# EAGLE design powerSMALL (EAGLE 9.0.0)
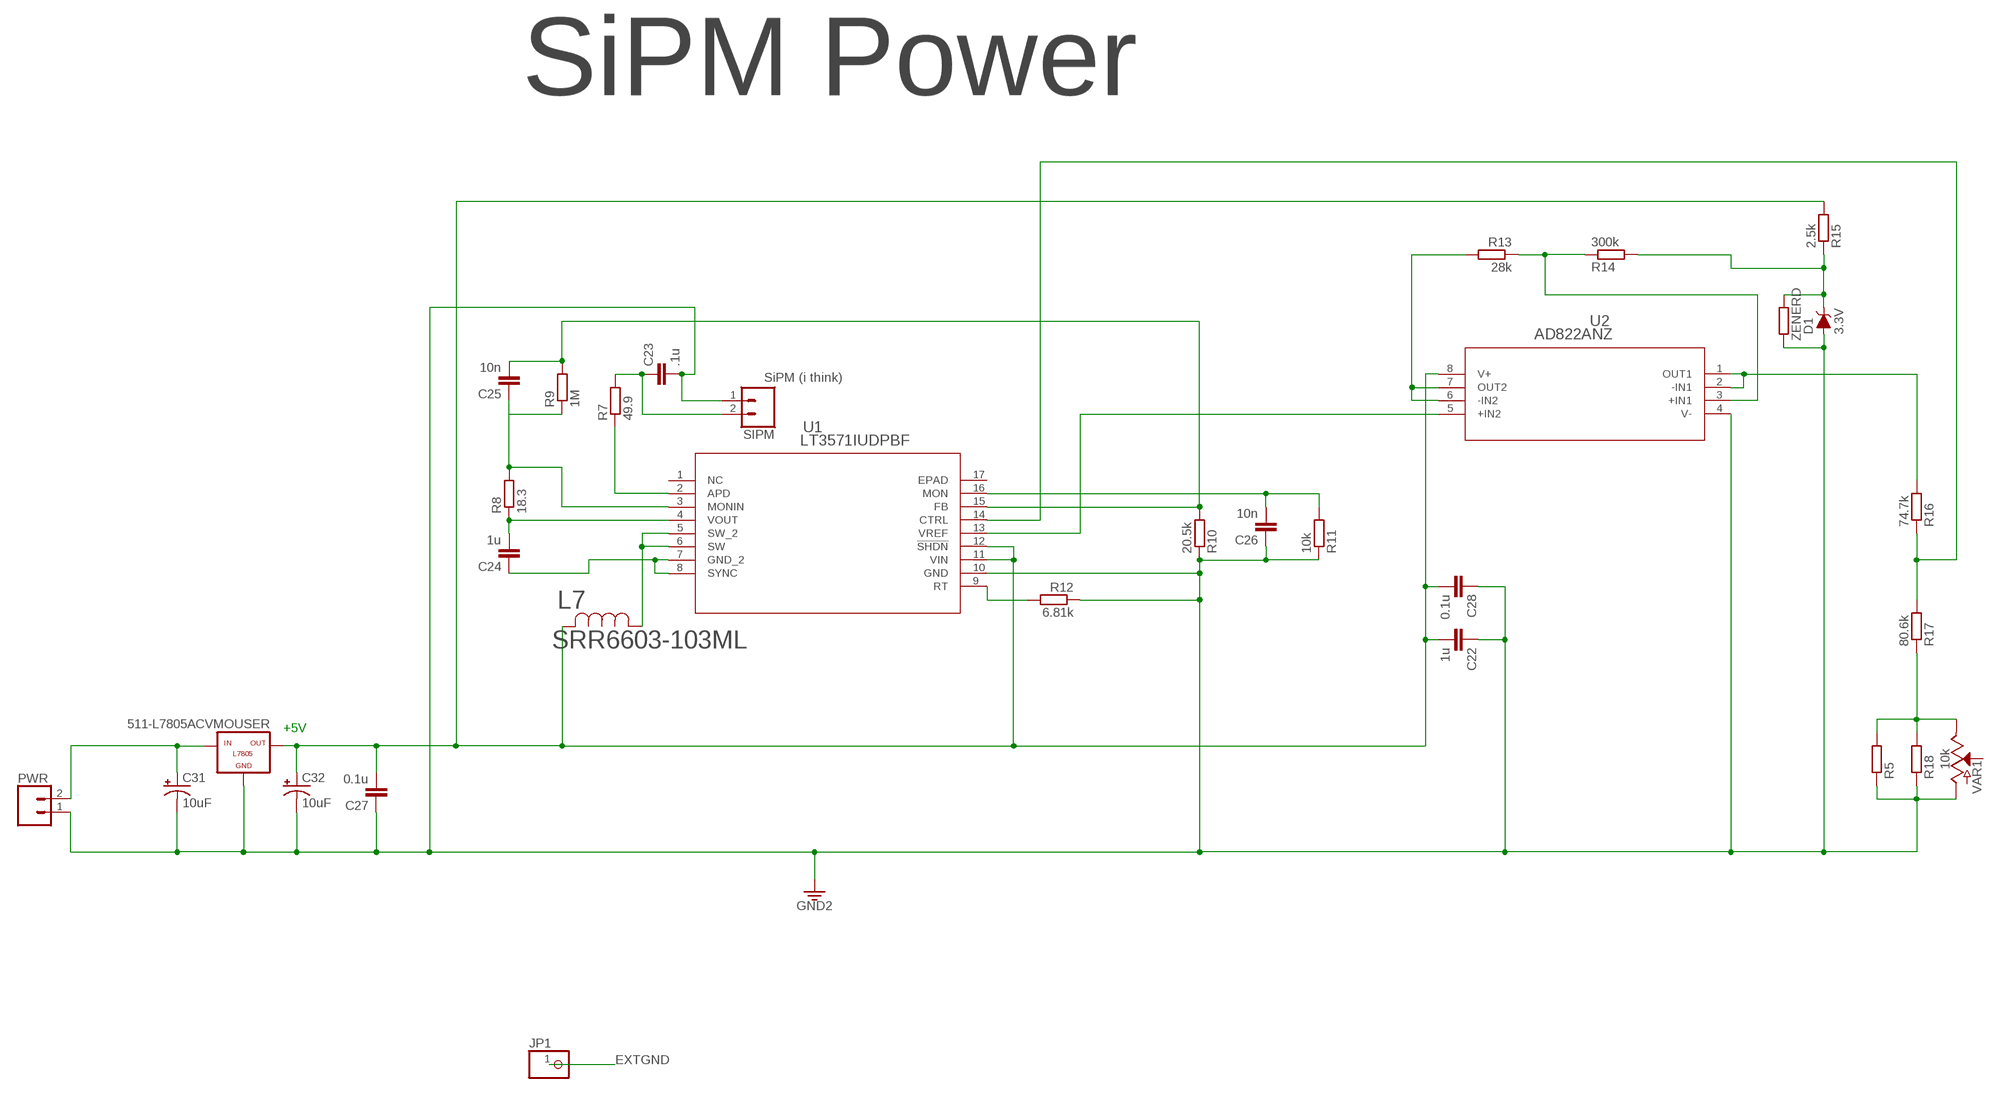
[diagram p0: schematic, sheet 1, part 1 of 2]
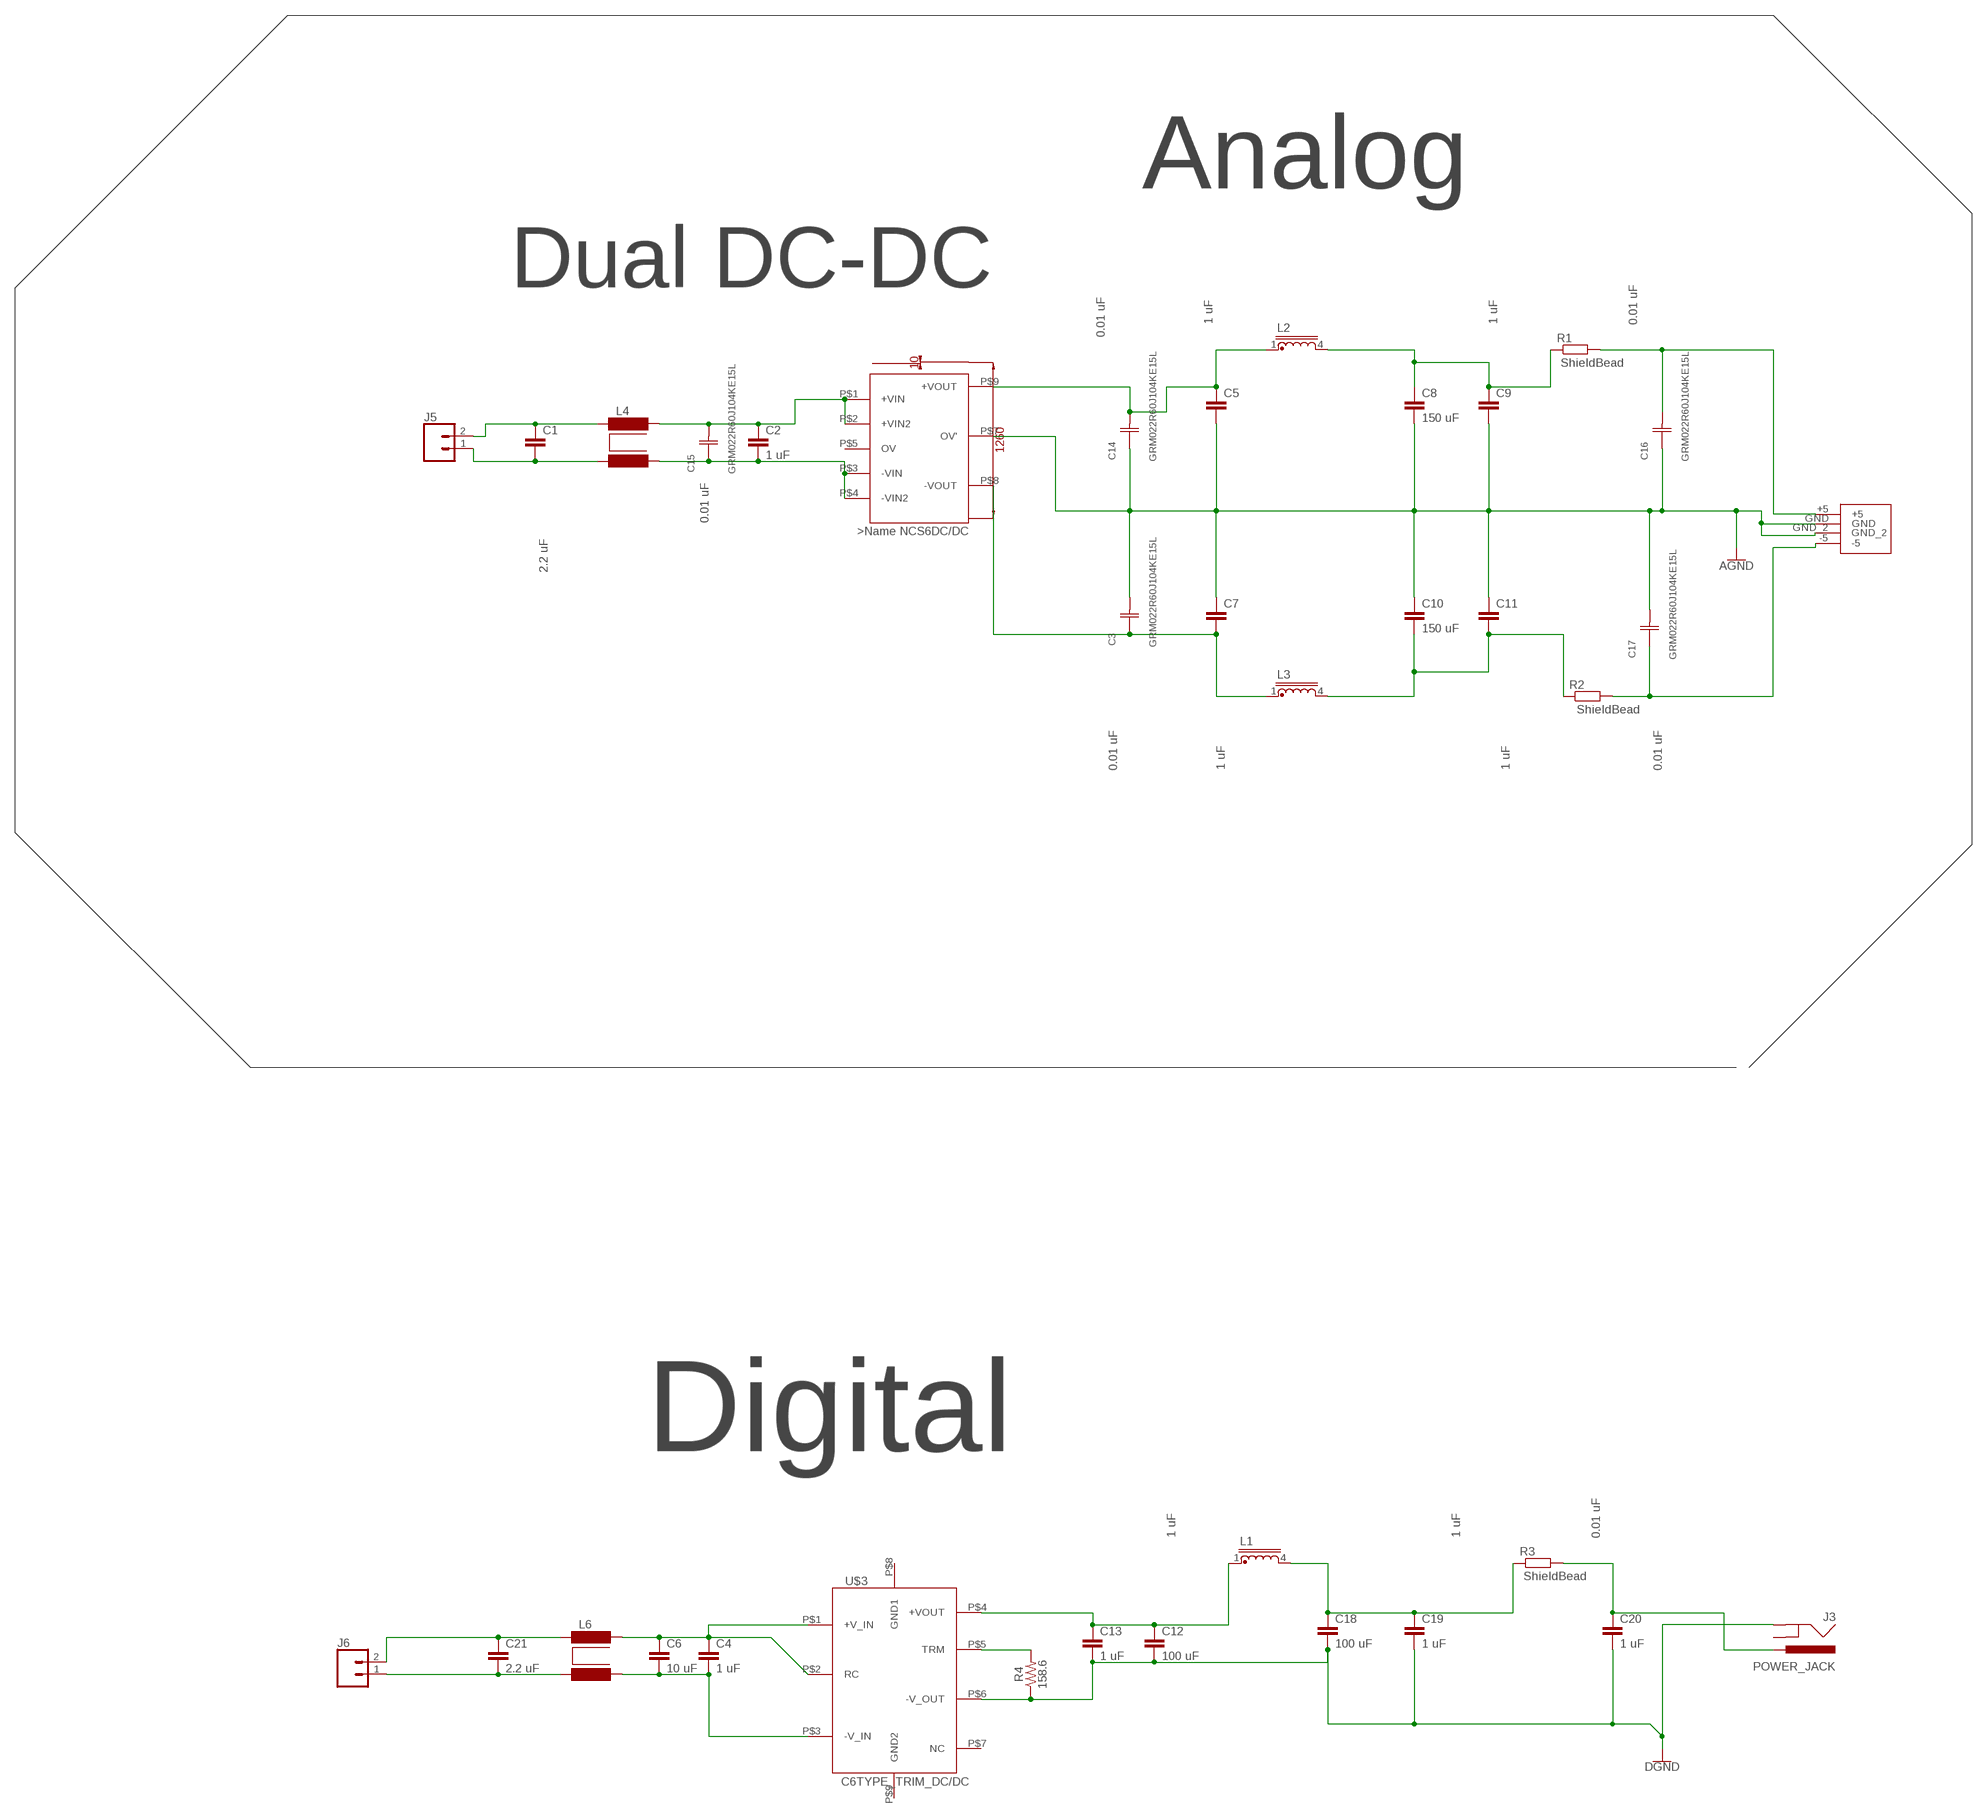
[diagram p1: schematic, sheet 1, part 2 of 2]

## Parts
511-L7805ACVMOUSER  -L7805  [L7805]
C1  C2.5/2  [C2.5-2]
C2  1 uF  10NF-PTH-10MM-10000V-1-%  [CAP-PTH-10MM]
C3  GRM022R60J104KE15L  [CAP_GRM02L_P42XP22]
C4  1 uF  10NF-PTH-10MM-10000V-1-%  [CAP-PTH-10MM]
C5  C2.5/2  [C2.5-2]
C6  10 uF  10NF-PTH-10MM-10000V-1-%  [CAP-PTH-10MM]
C7  C2.5/2  [C2.5-2]
C8  150 uF  10NF-PTH-10MM-10000V-1-%  [CAP-PTH-10MM]
C9  C2.5/2  [C2.5-2]
C10  150 uF  10NF-PTH-10MM-10000V-1-%  [CAP-PTH-10MM]
C11  C2.5/2  [C2.5-2]
C12  100 uF  10NF-PTH-10MM-10000V-1-%  [CAP-PTH-10MM]
C13  1 uF  10NF-PTH-10MM-10000V-1-%  [CAP-PTH-10MM]
C14  GRM022R60J104KE15L  [CAP_GRM02L_P42XP22]
C15  GRM022R60J104KE15L  [CAP_GRM02L_P42XP22]
C16  GRM022R60J104KE15L  [CAP_GRM02L_P42XP22]
C17  GRM022R60J104KE15L  [CAP_GRM02L_P42XP22]
C18  100 uF  10NF-PTH-10MM-10000V-1-%  [CAP-PTH-10MM]
C19  1 uF  10NF-PTH-10MM-10000V-1-%  [CAP-PTH-10MM]
C20  1 uF  10NF-PTH-10MM-10000V-1-%  [CAP-PTH-10MM]
C21  2.2 uF  10NF-PTH-10MM-10000V-1-%  [CAP-PTH-10MM]
C22  1u  C2.5/2  [C2.5-2]
C23  .1u  C2.5/2  [C2.5-2]
C24  1u  C2.5/2  [C2.5-2]
C25  10n  C2.5/2  [C2.5-2]
C26  10n  C2.5/2  [C2.5-2]
C27  0.1u  C2.5/2  [C2.5-2]
C28  0.1u  C2.5/2  [C2.5-2]
C31  10uF  10UF-POLAR-0603-6.3V-20%(TANT)  [0603-POLAR]
C32  10uF  10UF-POLAR-0603-6.3V-20%(TANT)  [0603-POLAR]
D1  3.3V  DIODE-ZENER-MM3Z3V3T1G  [SOD-323]
J3  POWER_JACK  [POWER_JACK_PTH]
J5  CONN_02PTH4  [1X02_XTRA_BIG]
J6  CONN_02PTH4  [1X02_XTRA_BIG]
JP1  PINHD-1X1  [1X01]
L1  U15-CHOKE  [U15CHOKE]
L2  U15-CHOKE  [U15CHOKE]
L3  U15-CHOKE  [U15CHOKE]
L4  SMR6-I  [SM-R6]
L6  SMR6-I  [SM-R6]
L7  SRR6603-103ML  [IND_BOURNS_SRR6603]
PWR  CONN_02PTH4  [1X02_XTRA_BIG]
R1  R0207/10  [0207/10]
R2  R0207/10  [0207/10]
R3  R0207/10  [0207/10]
R4  158.6  10MOHM-HORIZ-1/4W-5%  [AXIAL-0.3]
R5  R0207/10  [0207/10]
R7  49.9  R0207/10  [0207/10]
R8  18.3  R0207/10  [0207/10]
R9  1M  R0207/10  [0207/10]
R10  20.5k  R0207/10  [0207/10]
R11  10k  R0207/10  [0207/10]
R12  6.81k  R0207/10  [0207/10]
R13  28k  R0207/10  [0207/10]
R14  300k  R0207/10  [0207/10]
R15  2.5k  R0207/10  [0207/10]
R16  74.7k  R0207/10  [0207/10]
R17  80.6k  R0207/10  [0207/10]
R18  R0207/10  [0207/10]
SIPM  CONN_02PTH4  [1X02_XTRA_BIG]
U1  LT3571IUDPBF  [QFN-16_UD]
U2  AD822ANZ  [N_8]
U$1  NCS6D1205  [NCS6D1205C]
U$3  C6TYPE_TRIM_DC/DC  [CONV/DC/DC_6W_SNGL_C6TYPE]
U$4  WM403_NDPOWER_JACK  [WM4302-ND]
VAR1  10k  POTENTIOMETER-PTH-9MM-1/20W-20%  [POT-PTH-ALPS]
ZENERD  R0207/10  [0207/10]

## Nets
5VSUPPLY: 511-L7805ACVMOUSER.OUT C22.2 C27.2 C28.2 C32.+ L7.2 R15.2 U1.11(VIN) U1.12(!SHDN) U2.8(V+)
-FINV: C16.2 R1.2 U$4.+5
AGND: C3.2 C5.2 C7.1 C8.2 C9.2 C10.1 C11.1 C14.1 C16.1 C17.2 U$1.P$7(OV') U$4.GND U$4.GND_2
DGND: C12.2 C13.2 C18.2 C19.2 C20.2 J3.GND R4.P$1 U$3.P$6(-V_OUT)
EXTGND: JP1.1
N$1: C1.1 J5.2 L4.1
N$2: C1.2 J5.1 L4.4
N$3: C3.1 C7.2 L3.1 U$1.P$8(-VOUT)
N$4: C2.1 C15.2 L4.8 U$1.P$1(+VIN) U$1.P$2(+VIN2)
N$5: C5.1 C14.2 L2.1 U$1.P$9(+VOUT)
N$6: C8.1 C9.1 L2.4 R1.1
N$7: R13.2 U2.6(-IN2) U2.7(OUT2)
N$8: C10.2 C11.2 L3.4 R2.1
N$9: C17.1 R2.2 U$4.-5
N$10: C21.1 J6.2 L6.1
N$11: C21.2 J6.1 L6.4
N$12: C4.1 C6.1 L6.8 U$3.P$1(+V_IN) U$3.P$2(RC)
N$13: C4.2 C6.2 L6.5 U$3.P$3(-V_IN)
N$14: C24.2 R8.1 U1.4(VOUT)
N$15: C20.1 J3.PWR R3.2
N$16: R4.P$2 U$3.P$5(TRM)
N$17: C18.1 C19.1 L1.4 R3.1
N$18: C24.1 U1.7(GND_2) U1.8(SYNC)
N$19: C12.1 C13.1 L1.1 U$3.P$4(+VOUT)
N$20: R7.1 U1.2(APD)
N$21: C23.1 R7.2 SIPM.2
N$22: C25.1 R8.2 R9.1 U1.3(MONIN)
N$23: C26.2 R11.2 U1.16(MON)
N$24: L7.1 U1.5(SW_2) U1.6(SW)
N$25: U1.13(VREF) U2.5(+IN2)
N$27: R16.2 U2.1(OUT1) U2.2(-IN1)
N$28: C25.2 R9.2 R10.2 U1.15(FB)
N$29: R13.1 R14.1 U2.3(+IN1)
N$30: R12.2 U1.9(RT)
N$31: D1.C R14.2 R15.1 ZENERD.2
N$33: R16.1 R17.2 U1.14(CTRL)
N$34: R5.2 R17.1 R18.2 VAR1.P$1(E)
N$35: C2.2 C15.1 L4.5 U$1.P$3(-VIN) U$1.P$4(-VIN2)
N$36: 511-L7805ACVMOUSER.IN C31.+ PWR.2
SIPMGND: 511-L7805ACVMOUSER.GND C22.1 C23.2 C26.1 C27.1 C28.1 C31.- C32.- D1.A PWR.1 R5.1 R10.1 R11.1 R12.1 R18.1 SIPM.1 U1.10(GND) U2.4(V-) VAR1.P$3(A) ZENERD.1 ; supply symbol labelled GND2
Unconnected: J3.GNDBREAK U1.1(NC) U1.17(EPAD) U$1.P$5(OV) U$3.P$7(NC) U$3.P$8(GND1) U$3.P$9(GND2) VAR1.P$2(S)

## Notes on the sheet
- SiPM Power
- SiPM (i think)
- +5V
- Analog
- Dual DC-DC
- 1 uF | 1 uF
- 0.01 uF
- 0.01 uF
- ShieldBead
- 0.01 uF
- 2.2 uF
- ShieldBead
- 1 uF | 1 uF
- 0.01 uF | 0.01 uF
- Digital
- 1 uF | 1 uF
- 0.01 uF
- ShieldBead

## Library data of the parts
511-L7805ACVMOUSER = tango:-L7805
C1 C5 C7 C9 C11 C22-C28 = capacitor-wima:C: CAPACITOR naming: grid - package width
C2 C4 C6 C8 C10 C12 C13 C18-C21 = SparkFun-Capacitors:10NF: 0.01uF/10nF/10,000pF ceramic capacitors A capacitor is a passive two-terminal electrical component used to store electrical energy temporarily in an electric field. CAP-09321; PROD_ID: CAP-09321; VALUE: 10nF
C3 C14-C17 = 00_1uFCeramic:GRM022R60J104KE15L; MANUFACTURER_PART_NUMBER: GRM022R60J104KE15L; VENDOR: Murata
C31 C32 = SparkFun-Capacitors:10UF-POLAR: 10.0µF polarized capacitors A capacitor is a passive two-terminal electrical component used to store electrical energy temporarily in an electric field.; PROD_ID: CAP-13210
D1 = SparkFun-DiscreteSemi:DIODE-ZENER: Zener Diode A Zener diode allows current to flow from its anode to its cathode like a normal semiconductor diode, but it also permits current to flow in the reverse direction when its "Zener voltage" is reached. - WIkipedia; PROD_ID: DIO-11284
J3 = SparkFun-Connectors:POWER_JACK: Power Jack Connector This is the standard 5.5mm barrel jack for power. The PTH is the most common, proven, reliable, footprint. The Slot footprint only works if the mill layer is transmitted to the PCB fab house so be warned. Here are the connectors we sell at SparkFun: DC Barrel Power Jack/Connector <https://www.sparkfun.com/products/119> (PRT-00119) DC Barrel Power Jack/Connector (SMD) <https://www.sparkfun.com/products/12748> (PRT-12748) DC Barrel Jack Adapter - Breadboard Compatible <https://www.sparkfun.com/products/10811> (PRT-10811) It is used on this SparkFun product (and many, many others): SparkFun RedBoard - Programmed with Arduino <https://www.sparkfun.com/products/12757> (DEV-12757) Also, if you need a mating power supply or connector, please check these out: Wall Adapter Power Supply - 9VDC 650mA <https://www.sparkfun.com/products/298> (TOL-00298) DC Barrel Jack Adapter - Male <https://www.sparkfun.com/products/10287> (PRT-10287); PROD_ID: CONN-08197
J5 J6 PWR SIPM = SparkFun-Connectors:CONN_02: Multi connection point. Often used as Generic Header-pin footprint for 0.1 inch spaced/style header connections On any of the 0.1 inch spaced packages, you can populate with these: Break Away Headers - Straight <https://www.sparkfun.com/products/116> (PRT-00116) Break Away Male Headers - Right Angle <https://www.sparkfun.com/products/553> (PRT-00553) Female Headers <https://www.sparkfun.com/products/115> (PRT-00115) Break Away Headers - Machine Pin <https://www.sparkfun.com/products/117> (PRT-00117) Break Away Female Headers - Swiss Machine Pin <https://www.sparkfun.com/products/743> (PRT-00743) For SCREWTERMINALS and SPRING TERMINALS visit here: Screw Terimnals on SparkFun.com <https://www.sparkfun.com/search/results?term=Screw+Terminals> (5mm/3.5mm/2.54mm spacing) This device is also useful as a general connection point to wire up your design to another part of your project. Our various solder wires solder well into these plated through hole pads. Hook-Up Wire - Assortment (Stranded, 22 AWG) <https://www.sparkfun.com/products/11375> (PRT-11375) Hook-Up Wire - Assortment (Solid Core, 22 AWG) <https://www.sparkfun.com/products/11367> (PRT-11367) View the entire wire category on our website here <https://www.sparkfun.com/categories/141> Special notes: Molex polarized connector foot print use with: PRT-08233 with associated crimp pins and housings. 2.54_SCREWTERM for use with PRT-10571. 3.5mm Screw Terminal footprints for PRT-08084 5mm Screw Terminal footprints for use with PRT-08432
JP1 = adafruit:PINHD-1X1: Pin header 1x1 for 0.1" spacing With round pins
L1-L3 = inductor-neosid:U15-: CHOKE U15; OC_FARNELL: unknown; OC_NEWARK: unknown
L4 L6 = inductor-neosid:SMR6-I: CHOKE current compensated toroidal-core choke; OC_FARNELL: unknown; OC_NEWARK: unknown
L7 = SRR6603-10MLTR-ND:SRR6603-103ML; MANUFACTURER_PART_NUMBER: SRR6603103ML; VENDOR: Bourns Electronics
R1-R3 R5 R7-R18 ZENERD = eagle-ltspice:R: RESISTOR, European symbol; SPICEMODEL: NONE; SPICEPREFIX: R
R4 = SparkFun-Resistors:10MOHM: RES-09327; PROD_ID: RES-09327; VALUE: 10M
U1 = LT3571:LT3571IUDPBF; MANUFACTURER_PART_NUMBER: LT3571IUD#PBF; VENDOR: Linear Technology
U2 = AD822ANZ_opAmp:AD822ANZ; MANUFACTURER_PART_NUMBER: AD822ANZ; VENDOR: Analog Devices Inc
U$1 = LAFTRPWR:NCS6D1205
U$3 = DCDC_Trim:C6TYPE_TRIM_DC/DC
U$4 = WM4302-ND:WM403_ND
VAR1 = SparkFun-Resistors:POTENTIOMETER: Potentiometer (Pot) Three-terminal potentiometers, with an adjustable wiper and two adjustable resistors. A pot can be used to create a configurable voltage divider, or as a variable resistor. Variants ALPS_POT and ALPS_POT_KIT - PTH, breadboard compatible, 9mm square pots Rotary Potentiometer - Linear (10k ohm) <https://www.sparkfun.com/products/9288> (COM-09288) The KIT variant exposes copper on only one side of the PTH pad, so the part can only be assembled on one side of the PCB. Useful for beginner soldering kits.; PROD_ID: RES-09177; SF_SKU: COM-09288

## Board
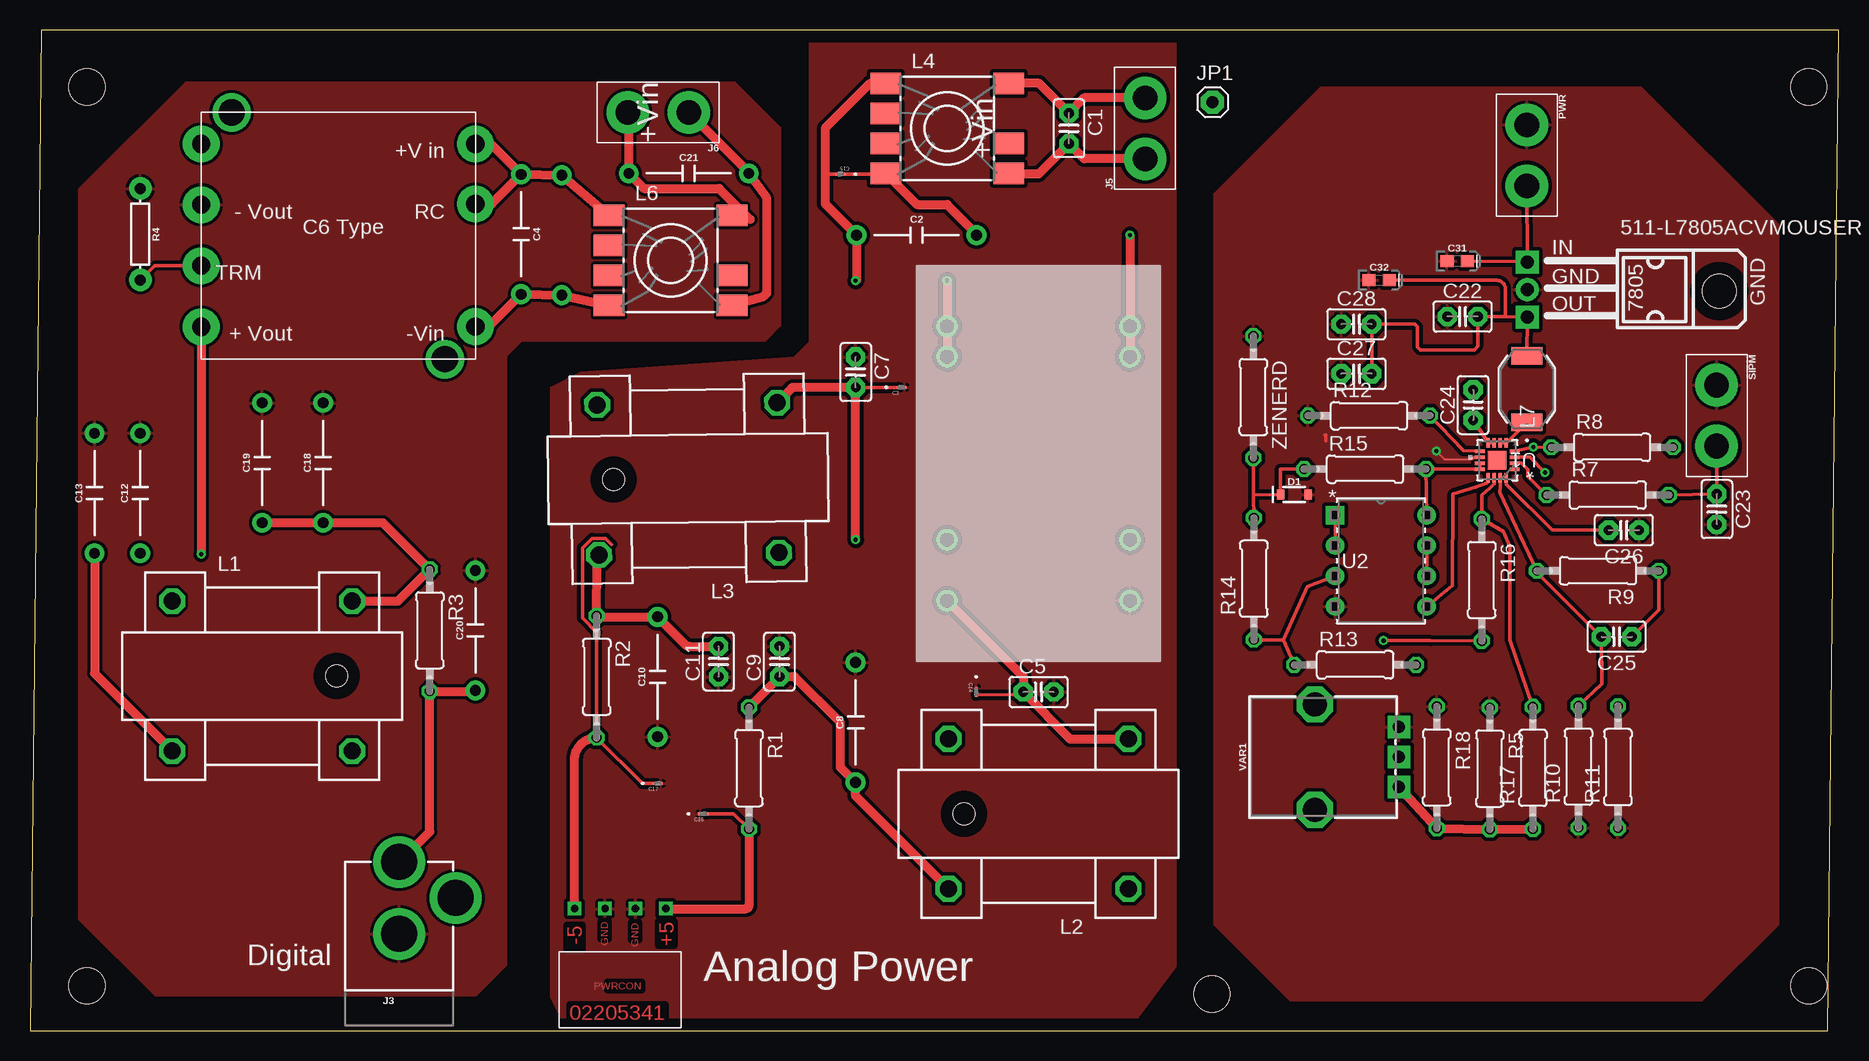
[diagram p2: board, top side]
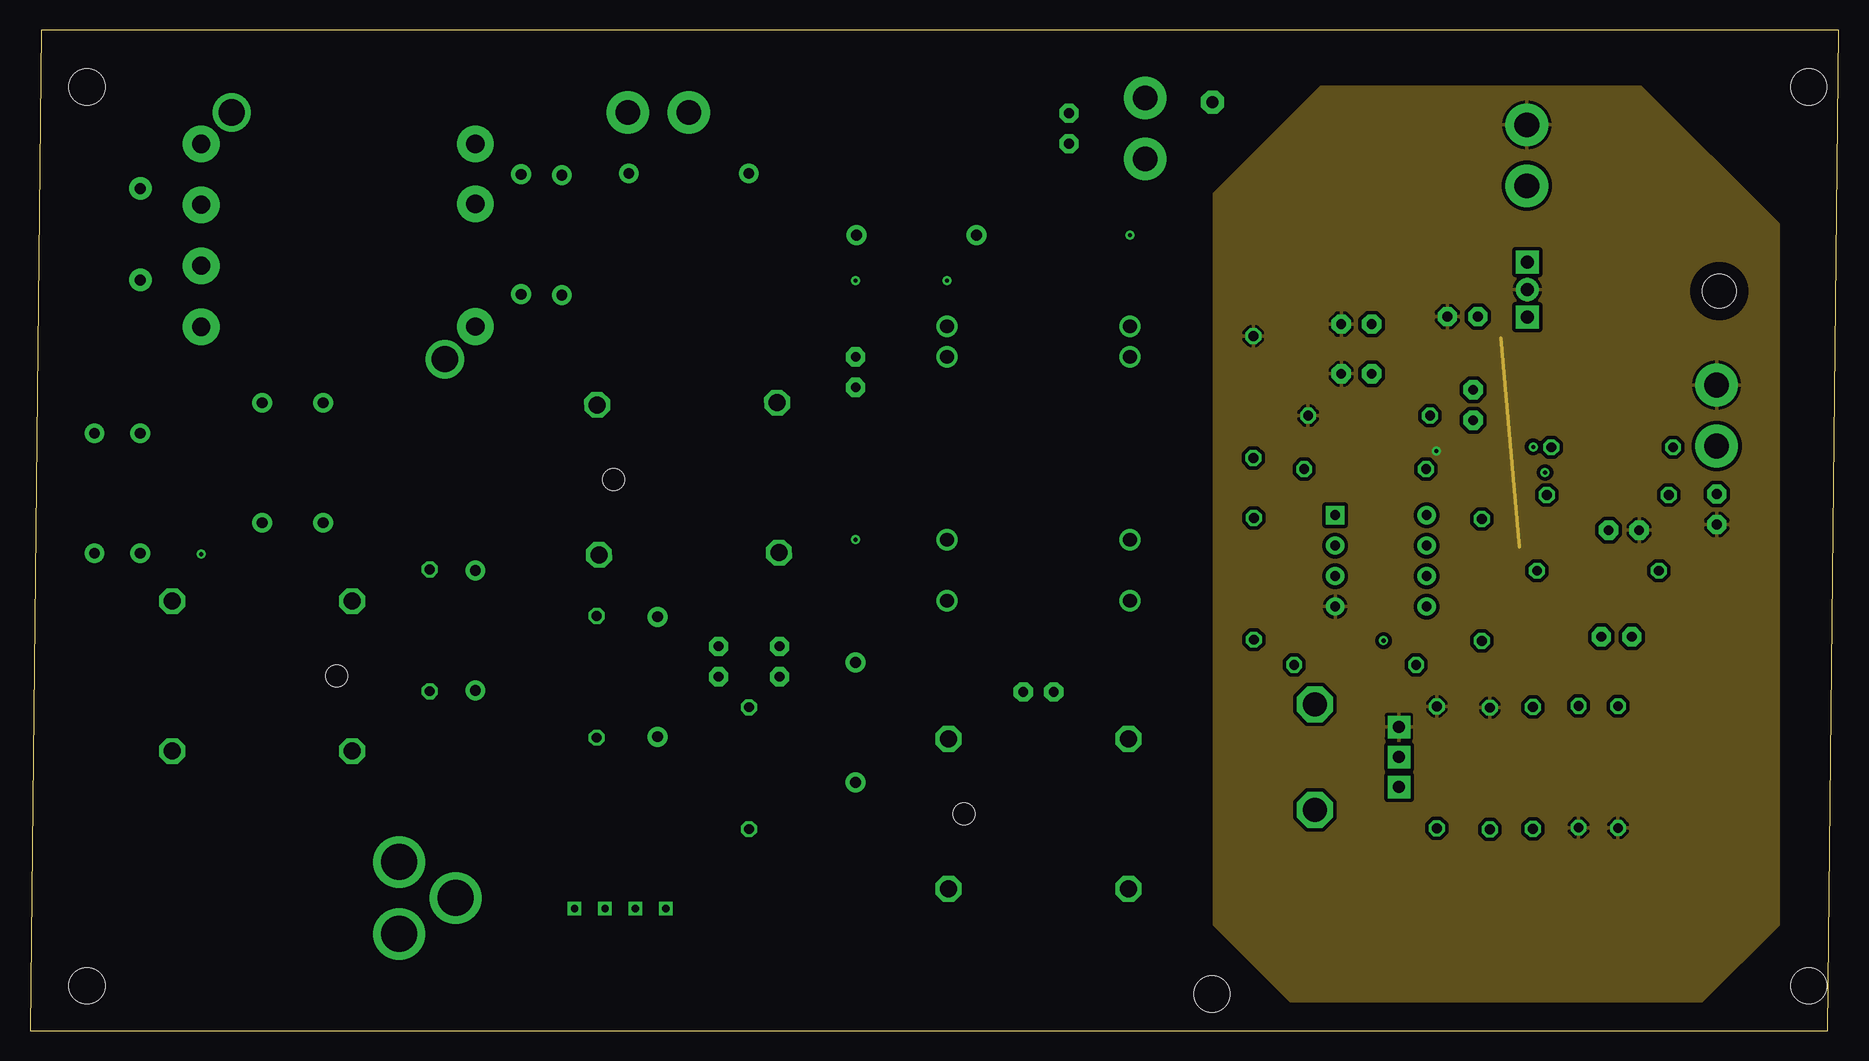
[diagram p3: board, inner layer Route2]
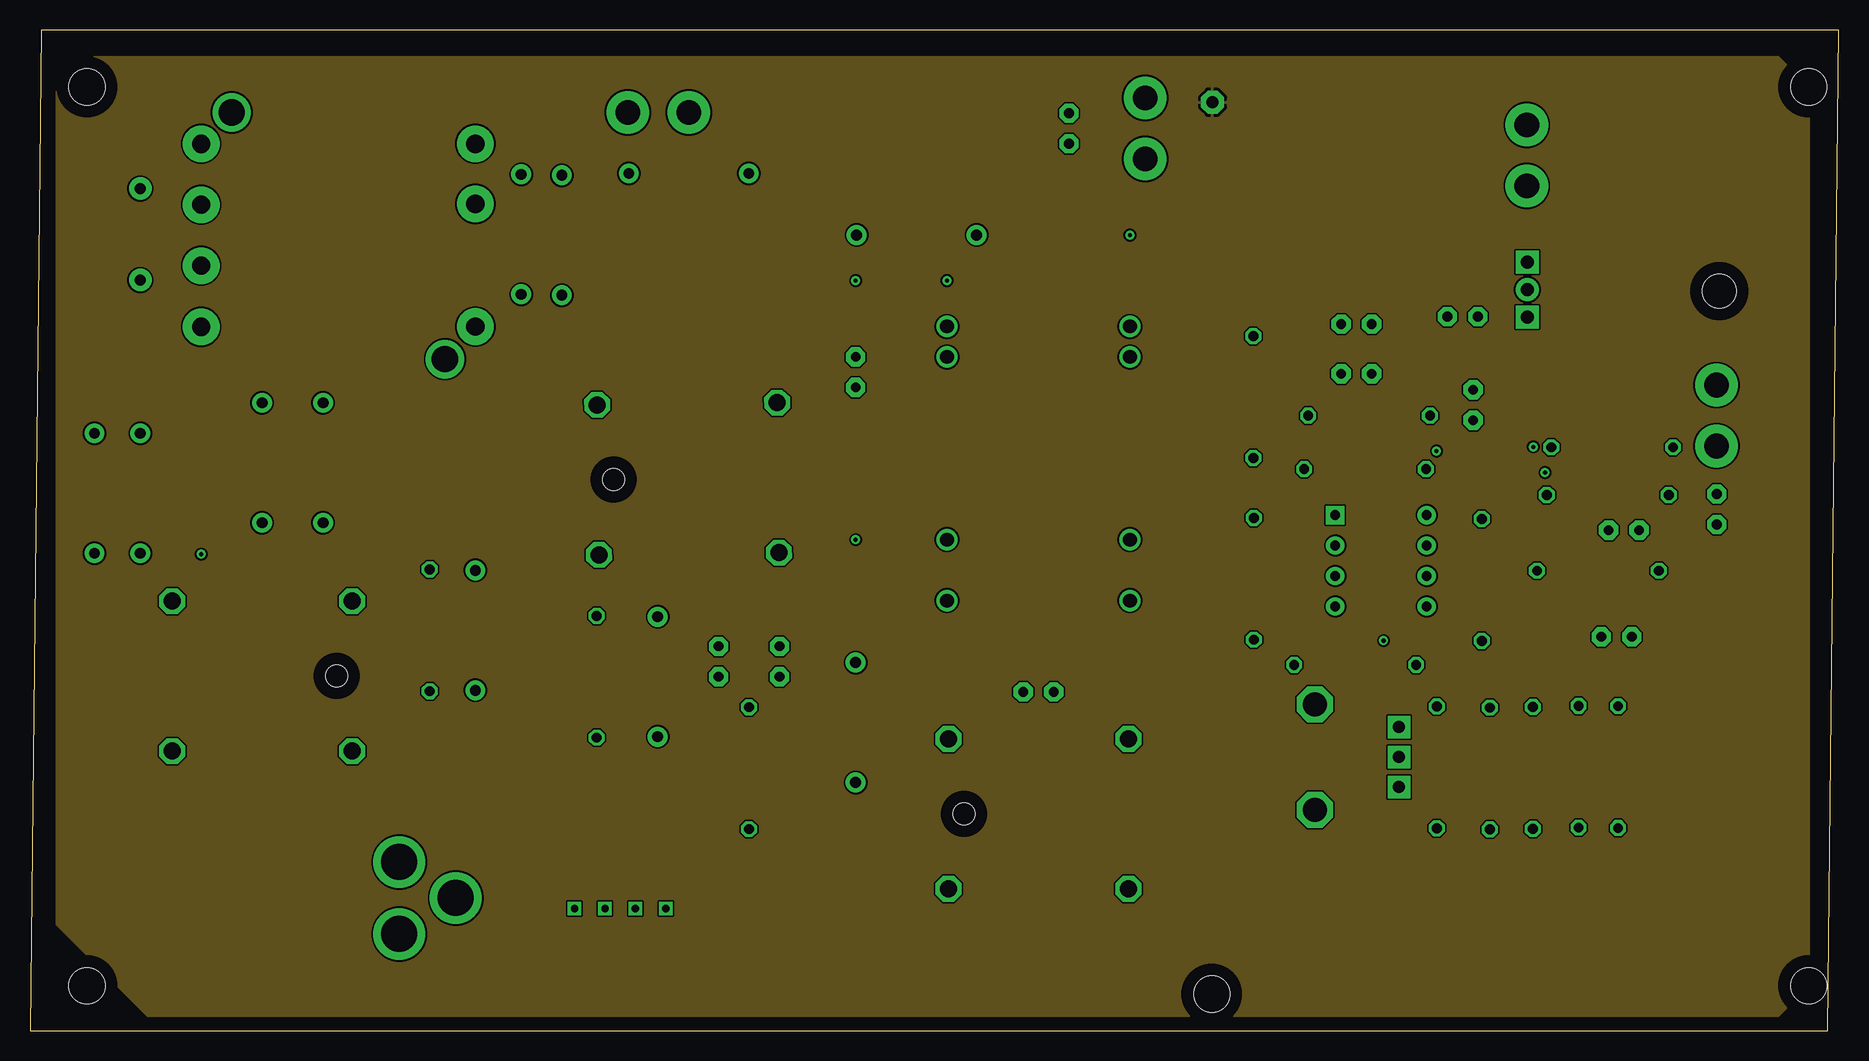
[diagram p4: board, inner layer Route15]
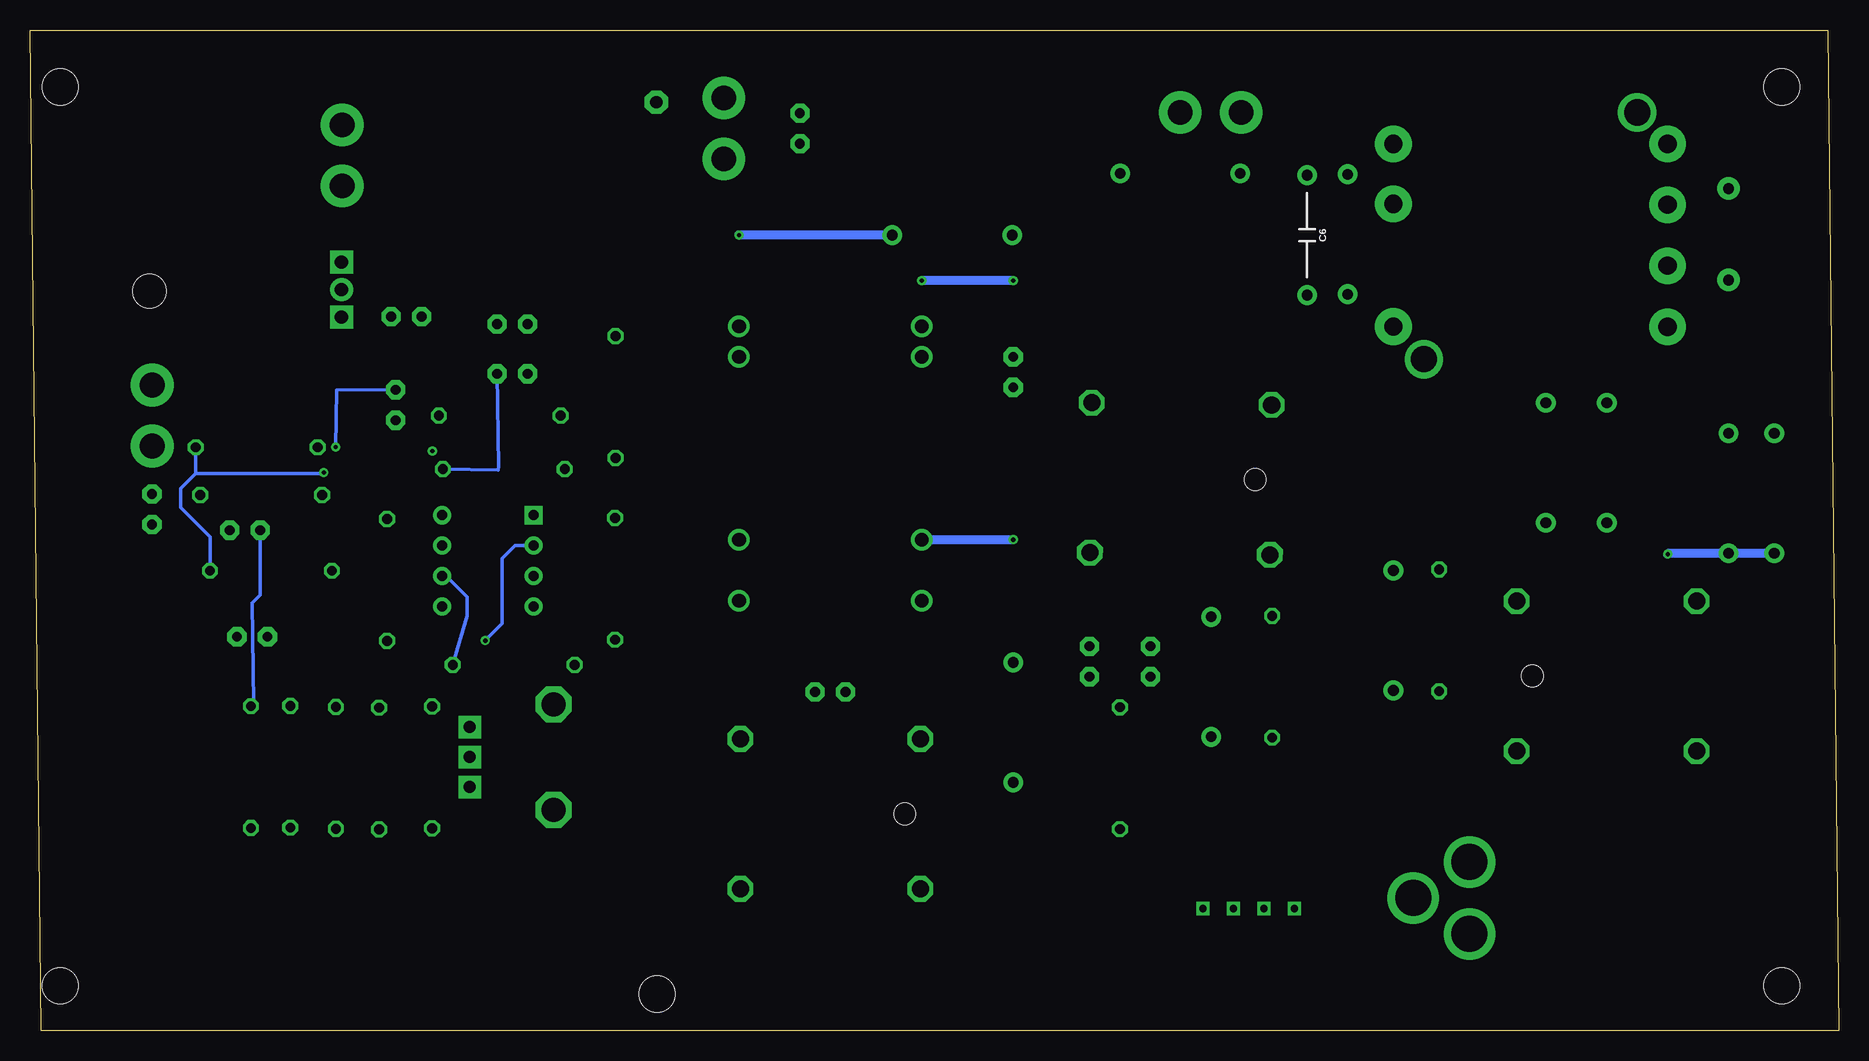
[diagram p5: board, bottom side, seen from below]

Size 150.78 x 83.42 mm. Coordinates in mm from the lower left corner, seen from the top.
Outline: 0,0 149.84,0 150.78,83.42 0.94,83.42 0,0
Copper layers (1*2+15*16): Top 0.035mm / dielectric 1.5mm / Route2 0.035mm / dielectric 0.15mm / Route15 0.035mm / dielectric 0.2mm / Bottom 0.035mm
Design rules "default *": minimum track width 6mil, minimum drill 0.35mm, track to track 6mil, track to pad 6mil, pad to pad 6mil, via to via 6mil, smd to smd 6mil, copper to edge 40mil, drill to drill 6mil, minimum pad ring 10mil, minimum via ring 8mil, stop-mask expansion 4mil, vias tented up to drill 0mil, thermal gap 10mil
Holes 3 mm at 4.75,78.67 4.75,3.74 98.51,3.05 148.26,3.74 148.26,78.67

### Footprints (pad centres in the part's own frame; a part is rotated, then mirrored left to right if it is on the bottom)
L7805 = drill 1.1 pad 1.93: GND 0.127,-9.652 | drill 1.1 pad 1.93 square: IN -2.159,-9.652; OUT 2.413,-9.652 | hole 2.8: 0.254,6.35
C2.5-2 = drill 0.813 pad 1.6 octagon: 1 -1.27,0; 2 1.27,0
CAP-PTH-10MM = drill 0.9 pad 1.651: 1 -5,0; 2 5,0
CAP_GRM02L_P42XP22 = smd 0.356 x 0.229: 1 -0.241,0; 2 0.241,0
0603-POLAR = smd 1.1 x 1: + 0.85,0; - -0.85,0
SOD-323 = smd 0.63 x 0.83: A 1.15,0; C -1.15,0
POWER_JACK_PTH = drill 2.997 pad 4.318: GND 0,7.7; GNDBREAK 4.7,10.7; PWR 0,13.7
1X02_XTRA_BIG = drill 2.057 pad 3.556: 1 -2.54,0; 2 2.54,0
1X01 = drill 1.016 pad 1.93 octagon: 1 0,0
U15CHOKE = drill 1.422 octagon: 1 -7.5,-6.25; 4 7.5,6.25; U2 -7.5,6.25; U3 7.5,-6.25 | hole 1.8: 6.2,0
SM-R6 = smd 1.8 x 2.55: 1 -3.75,5.125; 3 1.25,5.125; 4 3.75,5.125; 5 3.75,-5.125; 6 1.25,-5.125; 7 -1.25,-5.125; 8 -3.75,-5.125
IND_BOURNS_SRR6603 = smd 1.46 x 2.591: 1 -2.775,0; 2 2.775,0
0207/10 = drill 0.813 octagon: 1 -5.08,0; 2 5.08,0
AXIAL-0.3 = drill 0.9 pad 1.88: P$1 -3.81,0; P$2 3.81,0
QFN-16_UD = smd 0.805 x 0.3: 1 -1.452,0.75; 2 -1.452,0.25; 3 -1.452,-0.25; 4 -1.452,-0.75; 9 1.452,-0.75; 10 1.452,-0.25; 11 1.452,0.25; 12 1.452,0.75 | smd 0.3 x 0.805: 5 -0.75,-1.452; 6 -0.25,-1.452; 7 0.25,-1.452; 8 0.75,-1.452; 13 0.75,1.452; 14 0.25,1.452; 15 -0.25,1.452; 16 -0.75,1.452 | smd 1.55 x 1.55: 17 0,0
N_8 = drill 0.813 pad 1.524 square: 1 -7.62,7.62 | drill 0.813 pad 1.524: 2 -7.62,5.08; 3 -7.62,2.54; 4 -7.62,0; 5 0,0; 6 0,2.54; 7 0,5.08; 8 0,7.62
NCS6D1205C = drill 1.143 pad 1.778: P$1 0,0; P$2 2.54,0; P$3 0,15.24; P$4 2.54,15.24; P$5 17.78,15.24; P$7 22.86,15.24; P$8 17.78,0; P$9 22.86,0
CONV/DC/DC_6W_SNGL_C6TYPE = drill 1.524 pad 3.048: P$1 0,2.616; P$2 0,7.62; P$3 0,17.856; P$4 22.86,17.882; P$5 22.86,12.776; P$6 22.86,7.696; P$7 22.86,2.616 | drill 2.184 pad 3.048: P$8 2.54,20.574; P$9 20.32,0
WM4302-ND = drill 0.6 square: +5 1.27,-3.58; -5 8.89,-3.58; GND 3.81,-3.58; GND_2 6.35,-3.58
POT-PTH-ALPS = drill 1 pad 1.88 square: P$1 7,-2.5; P$2 7,0; P$3 7,2.5 | drill 2 octagon: P$4 0,-4.4; P$5 0,4.4

### Placement (x,y rotation side)
511-L7805ACVMOUSER  134.47,61.9 270 top
C1  86.6,75.22 270 top
C2  73.9,66.33 0 top
C3  72.63,53.63 0 top
C4  40.94,66.39 270 top
C5  84.06,28.23 0 top
C6  44.33,66.31 270 bottom
C7  68.82,54.9 270 top
C8  68.82,25.69 90 top
C9  62.47,30.77 90 top
C10  52.31,29.5 90 top
C11  57.39,30.77 90 top
C12  9.19,44.8 90 top
C13  5.38,44.8 90 top
C14  78.87,28.25 270 top
C15  67.55,71.41 180 top
C16  56.12,18.07 0 top
C17  52.31,20.61 0 top
C18  24.43,47.34 90 top
C19  19.35,47.34 90 top
C20  37.13,33.37 90 top
C21  54.91,71.47 0 top
C22  119.41,59.53 0 top
C23  140.61,43.47 270 top
C24  120.29,52.16 90 top
C25  132.25,32.84 180 top
C26  132.86,41.72 180 top
C27  110.57,54.76 0 top
C28  110.57,58.9 0 top
C31  118.97,64.16 0 top
C32  112.46,62.56 0 top
D1  105.39,44.69 0 top
J3  30.78,0.35 0 top
J5  92.95,75.22 90 top
J6  52.37,76.55 180 top
JP1  98.57,77.4 0 top
L1  19.35,29.56 0 top
L2  84.06,18.07 180 top
L3  54.85,46.01 180.7 top
L4  76.44,75.22 270 top
L6  53.4,64.21 270 top
L7  124.78,53.48 90 top
PWR  124.76,72.97 270 top
R1  59.93,21.88 270 top
R2  47.23,29.5 270 top
R3  33.32,33.37 270 top
R4  9.19,66.39 270 top
R5  121.69,21.85 270 top
R7  131.51,44.65 0 top
R8  131.88,48.63 0 top
R9  130.7,38.34 180 top
R10  129.08,22 90 top
R11  132.37,21.97 90 top
R12  111.62,51.27 0 top
R13  110.46,30.49 0 top
R14  102.02,37.67 90 top
R15  111.29,46.82 0 top
R16  121.01,37.57 270 top
R17  125.27,21.9 90 top
R18  117.27,21.94 270 top
SIPM  140.59,51.27 270 top
U1  122.31,47.55 180 top
U2  116.42,35.36 0 top
U$1  76.44,58.71 270 top
U$3  37.13,76.55 180 top
U$4  54.28,6.59 180 top
VAR1  107.12,22.81 0 top
ZENERD  101.97,52.82 270 top

### Tracks (layer width: path | path; a pad name or v marks a point on that pad's centre or on a via)
5VSUPPLY
  Top 0.305: U1.11 U1.12 R15.2 U2.8 | 122.95,59.51 C22.2 120.68,57.05 120.38,56.75 115.89,56.75 115.66,56.98 115.66,58.68 115.45,58.9 C28.2 C27.2 | 122.95,59.51 511-L7805ACVMOUSER.OUT L7.2 | C32.+ 122.23,62.56 arc-90 122.99,61.8 122.99,59.54 arc-90 122.95,59.51
  Bottom 0.305: C27.2 111.72,47.03 111.78,46.72 R15.2
-FINV
  Top 0.305: R1.2 58.66,18.07 C16.2
  Top 0.762: R1.2 59.93,10.45 arc-90 59.65,10.17 U$4.+5
AGND
  pour Route2 (isolate 0.356): -53.67,116.77 -53.67,91.37 -54.94,90.1 -73.99,88.83 -75.26,87.56 -75.26,34.22 -27,34.22 -23.19,39.3 -23.19,116.77
  pour Top (isolate 0.305): 65.01,82.84 95.49,82.84 95.49,5.37 91.68,0.29 44.69,0.29 43.42,2.83 43.42,53.63 45.96,54.9 63.74,56.17 65.01,57.44
DGND
  pour Route2 (isolate 0.305): -99.39,82.48 -95.58,77.4 -95.58,62.16 -96.85,60.89 -117.17,60.89 -118.44,58.35 -118.44,8.82 -120.98,6.28 -147.65,6.28 -154,12.63 -154,73.59 -145.11,82.48
  pour Top (isolate 0.254): 4.11,70.2 13,79.09 58.72,79.09 62.53,75.28 62.53,58.77 61.26,57.5 40.94,57.5 39.67,56.23 39.67,5.43 37.13,2.89 10.46,2.89 4.11,9.24
EXTGND
  pour Route15: 3.48,81.21 145.72,81.21 148.26,78.67 148.26,3.74 145.72,1.2 9.83,1.2 2.21,8.82 2.21,79.94
N$1
  Top 0.762: J5.2 87.87,77.76 C1.1 84.12,78.97 L4.1
N$2
  Top 0.762: J5.1 87.87,72.68 C1.2 84.06,71.41 81.63,71.41 L4.4
N$3  (via drill 0.35)
  Top 0.305: C7.2 C3.1
  Top 0.762: v68.82,40.93 C7.2 63.68,53.63 arc45 63.47,53.54 L3.1
  Bottom 0.762: U$1.P$8 v68.82,40.93
N$4  (via drill 0.35)
  Top 0.305: C15.2 66.28,71.41
  Top 0.762: v68.82,62.52 68.9,62.6 C2.1 66.28,68.95 66.28,71.41 66.28,75.22 70.03,78.97 L4.8 | v76.44,62.52 U$1.P$1 U$1.P$2
  Bottom 0.762: v68.82,62.52 v76.44,62.52
N$5
  Top 0.305: C14.2 82.55,27.99 C5.1
  Top 0.762: U$1.P$9 82.79,29.5 C5.1 86.7,24.32 L2.1
N$6
  Top 0.762: L2.4 68.82,19.56 C8.1 67.55,21.96 67.55,25.69 63.74,29.5 C9.1 R1.1
N$7
  Top 0.305: U2.7 U2.6
  Bottom 0.305: U2.6 116.08,37.89 114.33,36.14 114.33,34.55 R13.2
N$8
  Top 0.762: C11.2 54.9,32.04 arc-45 54.69,32.13 C10.2 47.43,34.5 arc-45 R2.1 47.26,39.17 L3.4
N$9
  Top 0.305: C17.1 51.04,20.61 R2.2 47.23,33.21 46.05,34.39 46.05,40.24 46.86,41.05 48,41.05 48.49,40.55
  Top 0.762: U$4.-5 45.39,22.57 arc-90 R2.2
N$10
  Top 0.762: J6.2 49.91,76.47 C21.1 51.18,70.2 57.45,70.2 60.04,67.61 L6.1
N$11
  Top 0.762: J6.1 59.91,71.55 C21.2 61.38,69.46 61.38,61.41 61.28,61.35 61.1,61.17 L6.4
N$12
  Top 0.762: C4.1 38.4,73.93 U$3.P$1 | C4.1 38.48,68.93 U$3.P$2 | C4.1 C6.1 L6.8
N$13
  Top 0.762: U$3.P$3 38.25,58.69 C4.2 C6.2 L6.5
N$14  (via drill 0.35)
  Top 0.305: U1.4 v125.31,48.66 R8.1
  Bottom 0.305: v125.31,48.66 125.23,53.39 C24.2
N$15
  Top 0.762: C20.1 37.05,28.29 R3.2 33.32,16.59 J3.PWR
N$16
  Top 0.305: U$3.P$5 10.39,63.77 R4.P$2
N$17
  Top 0.762: L1.4 30.68,35.81 R3.1 29.43,42.34 C18.1 C19.1
N$18
  Top 0.305: U1.7 U1.8 C24.1
N$19  (via drill 0.35)
  Top 0.762: U$3.P$4 v14.27,39.72 | C13.1 5.38,29.78 L1.1
  Bottom 0.762: v14.27,39.72 14.19,39.8 C12.1 C13.1
N$20
  Top 0.305: U1.2 124.32,47.3 124.85,46.77 124.85,46.21 126.41,44.65 R7.1
N$21
  Top 0.305: R7.2 C23.1 SIPM.2
N$22  (via drill 0.35)
  Top 0.305: U1.3 125.01,47.8 v126.29,46.53 | C25.1 135.78,35.09 R9.1
  Bottom 0.305: R8.2 136.96,46.45 | 136.96,46.45 138.22,45.2 138.22,43.62 135.75,41.14 135.75,38.37 R9.1 | 136.96,46.45 126.36,46.45 v126.29,46.53
N$23
  Top 0.305: U1.16 123.06,45.54 126.88,41.72 C26.2
  Bottom 0.305: C26.2 131.59,36.31 132.25,35.65 132.13,27.29 R11.2
N$24
  Top 0.305: U1.6 U1.5 L7.1
N$25
  Top 0.305: U2.5 118.58,37.11 118.61,44.72 120.54,45.32 121.44,45.65 121.54,45.75 U1.13
N$27  (via drill 0.35)
  Top 0.305: U2.2 U2.1 | R16.2 116.74,32.51 v112.83,32.51
  Bottom 0.305: U2.2 110.33,40.43 111.41,39.36 111.41,33.93 v112.83,32.51
N$28
  Top 0.305: R10.2 131,28.89 C25.2 125.62,38.2 R9.2 122.53,44.88 122.56,45.46 U1.15
N$29
  Top 0.305: R14.1 104.47,32.59 | 104.47,32.59 106.47,37.02 U2.3 | 104.47,32.59 R13.1
N$30
  Top 0.305: R12.2 119.46,48.35 U1.9
N$31
  Top 0.305: ZENERD.2 102,44.67 | 102,44.67 R14.2 | R15.1 104.21,46.82 D1.C 102,44.67
N$33
  Top 0.305: U1.14 122.06,45.62 arc-90 122.01,45.57 121.7,45.26 121.02,44.67 R16.1 122.8,41.59 123.35,40.36 123.37,32.56 R17.2
N$34
  Top 0.762: VAR1.P$1 R18.2 R5.2 R17.1
N$35  (via drill 0.35)
  Top 0.305: C15.1 70.09,71.41 70.15,71.47 L4.5
  Top 0.762: L4.5 73.92,68.87 76.44,68.87 78.9,66.41 C2.2 | v91.68,66.33 U$1.P$3 U$1.P$4
  Bottom 0.762: C2.2 v91.68,66.33
N$36
  Top 0.305: PWR.2 124.81,64.12 | 124.81,64.12 511-L7805ACVMOUSER.IN | C31.+ 124.81,64.12
SIPMGND  (via drill 0.35)
  Top 0.152: v117.24,48.32 117.24,48.3 117.89,47.64 120.26,47.64 120.41,47.79
  Top 0.305: 107.93,49.65 108.01,49.64 108.01,49.2 | 124.75,75.49 arc90 PWR.1 | U1.10 120.41,47.79 120.36,47.79
  Route2 0.305: 122.62,57.73 124.13,40.32 124.13,40.57
  pour Route2 (isolate 0.305): 134.29,78.67 145.72,67.24 145.72,8.82 139.37,2.47 105.08,2.47 98.73,8.82 98.73,69.78 107.62,78.67
  pour Top (isolate 0.305): 107.62,78.67 134.29,78.67 145.72,67.24 145.72,8.82 139.37,2.47 105.08,2.47 98.73,8.82 98.73,69.78

### Text on the board
tSilk: +Vin | +Vin | Digital | Analog Power